# EAGLE schematic phoenixRev2 (EAGLE 8.5.2)

## Sheet 1 of 2
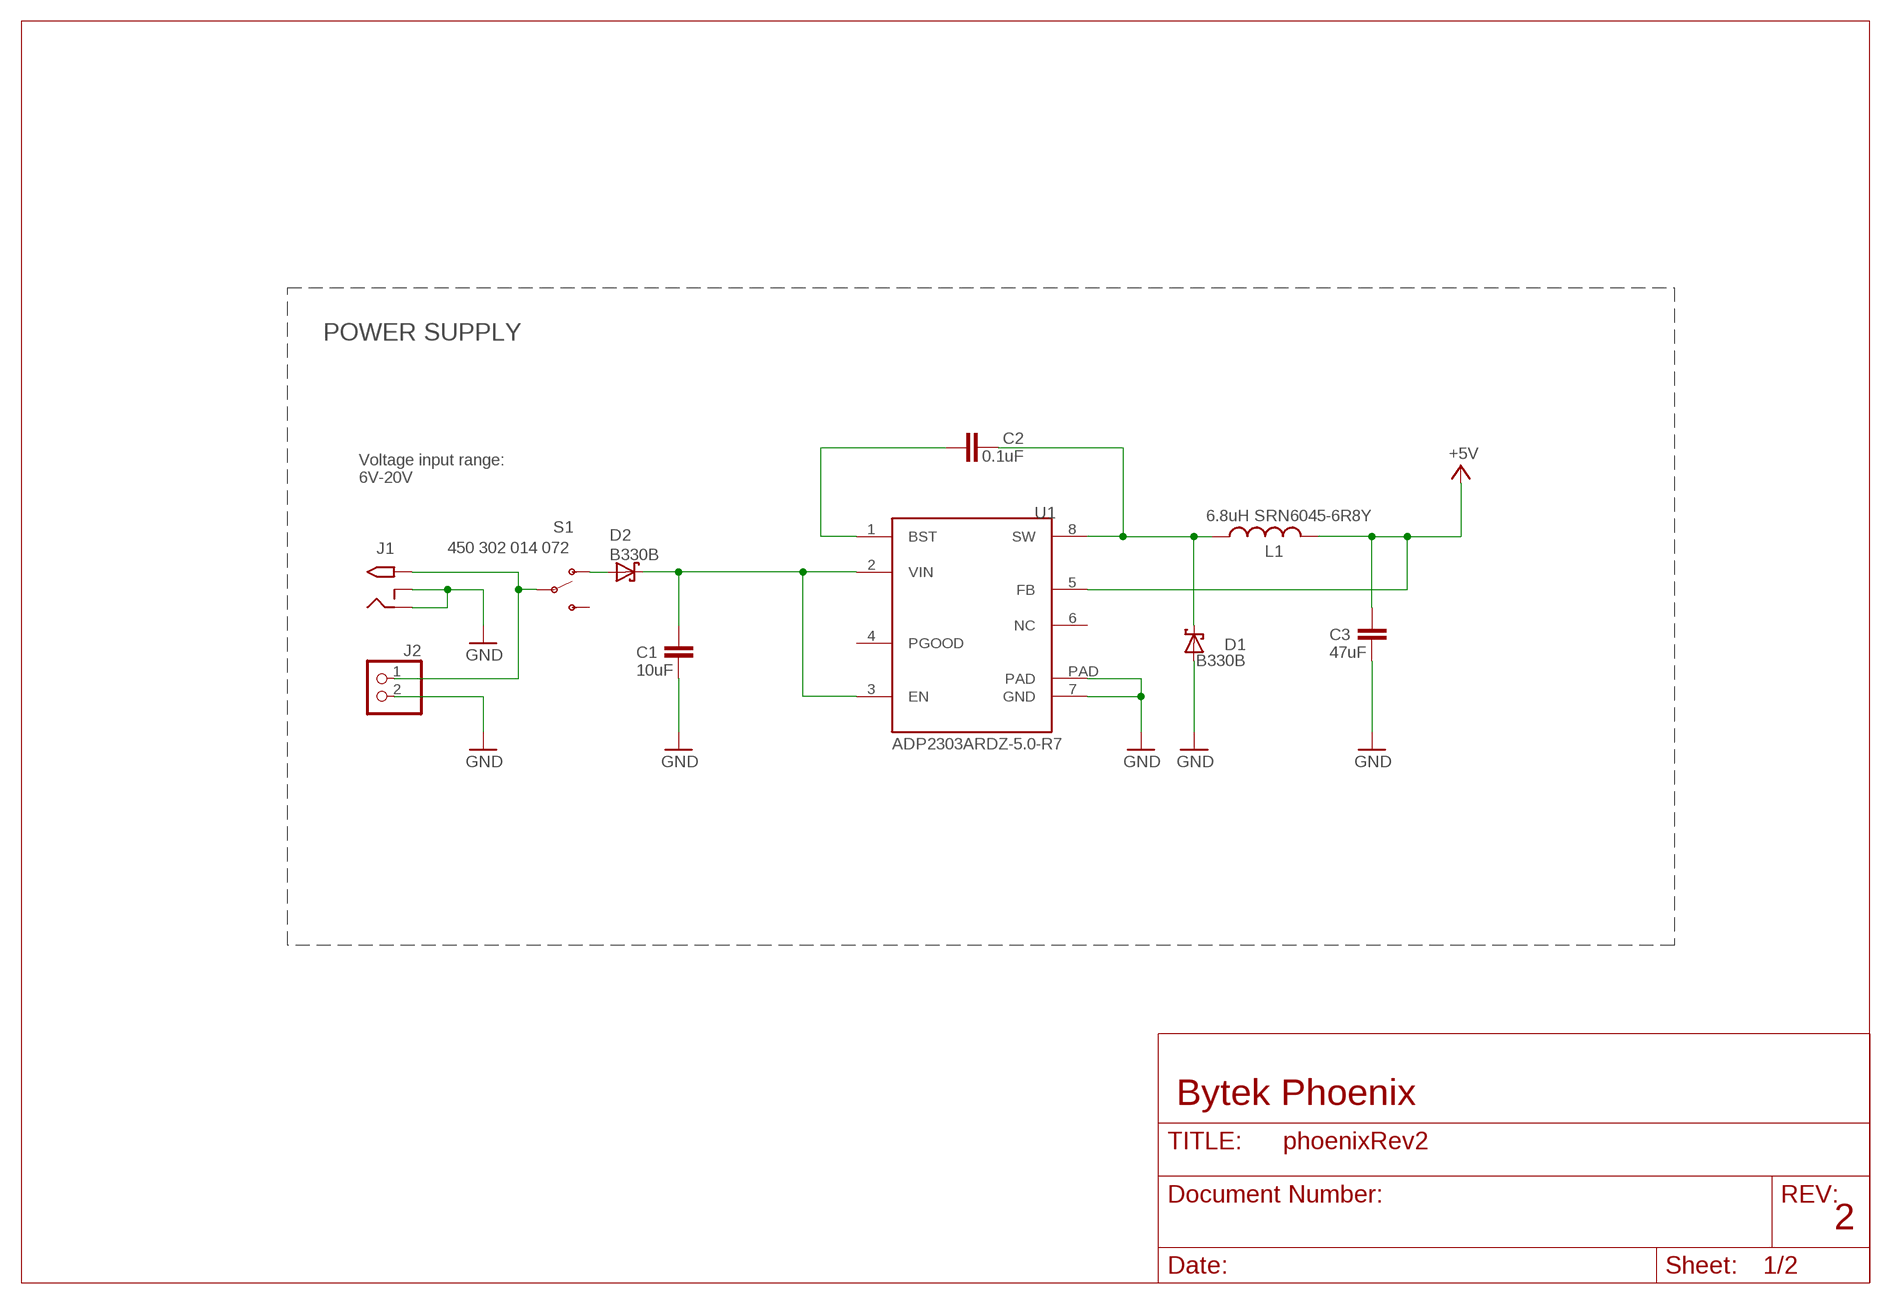
[diagram p0: schematic, sheet 1]

### Parts
C1  10uF  C-EUC0805  [C0805]
C2  0.1uF  C-EUC0805  [C0805]
C3  47uF  C-EUC1206  [C1206]
D1  B330B  SCHOTTKY-DIODESMD  [SMB]
D2  B330B  SCHOTTKY-DIODESMD  [SMB]
J1  2.1MMJACKTHM  [PJ-102A]
J2  PINHD-1X2  [1X02]
L1  6.8uH SRN6045-6R8Y  L-USWE-TPC  [POWER-CHOKE_WE-TPC]
S1  450 302 014 072  SWITCH-SPDT-PTH-11.6X4.0MM  [SWITCH_SPDT_PTH_11.6X4.0MM]
U1  ADP2303ARDZ-5.0-R7  ADP2303  [SO08_PAD]

### Nets
+5V: C3.1 L1.2 U1.5(FB) ; also sheet 2
GND: C1.2 C3.2 D1.A J1.RING J1.RING_SW J2.2 U1.7(GND) U1.PAD ; also sheet 2
N$1: D2.A S1.1(O)
N$24: C2.1 U1.1(BST)
N$32: C2.2 D1.C L1.1 U1.8(SW)
N$33: C1.1 D2.C U1.2(VIN) U1.3(EN)
N$36: J1.TIP J2.1 S1.2(P)
Unconnected: S1.3(S) U1.4(PGOOD) U1.6(NC)

### Notes on the sheet
- POWER SUPPLY
- Voltage input range:
  6V-20V
- Bytek Phoenix
- 2

## Sheet 2 of 2
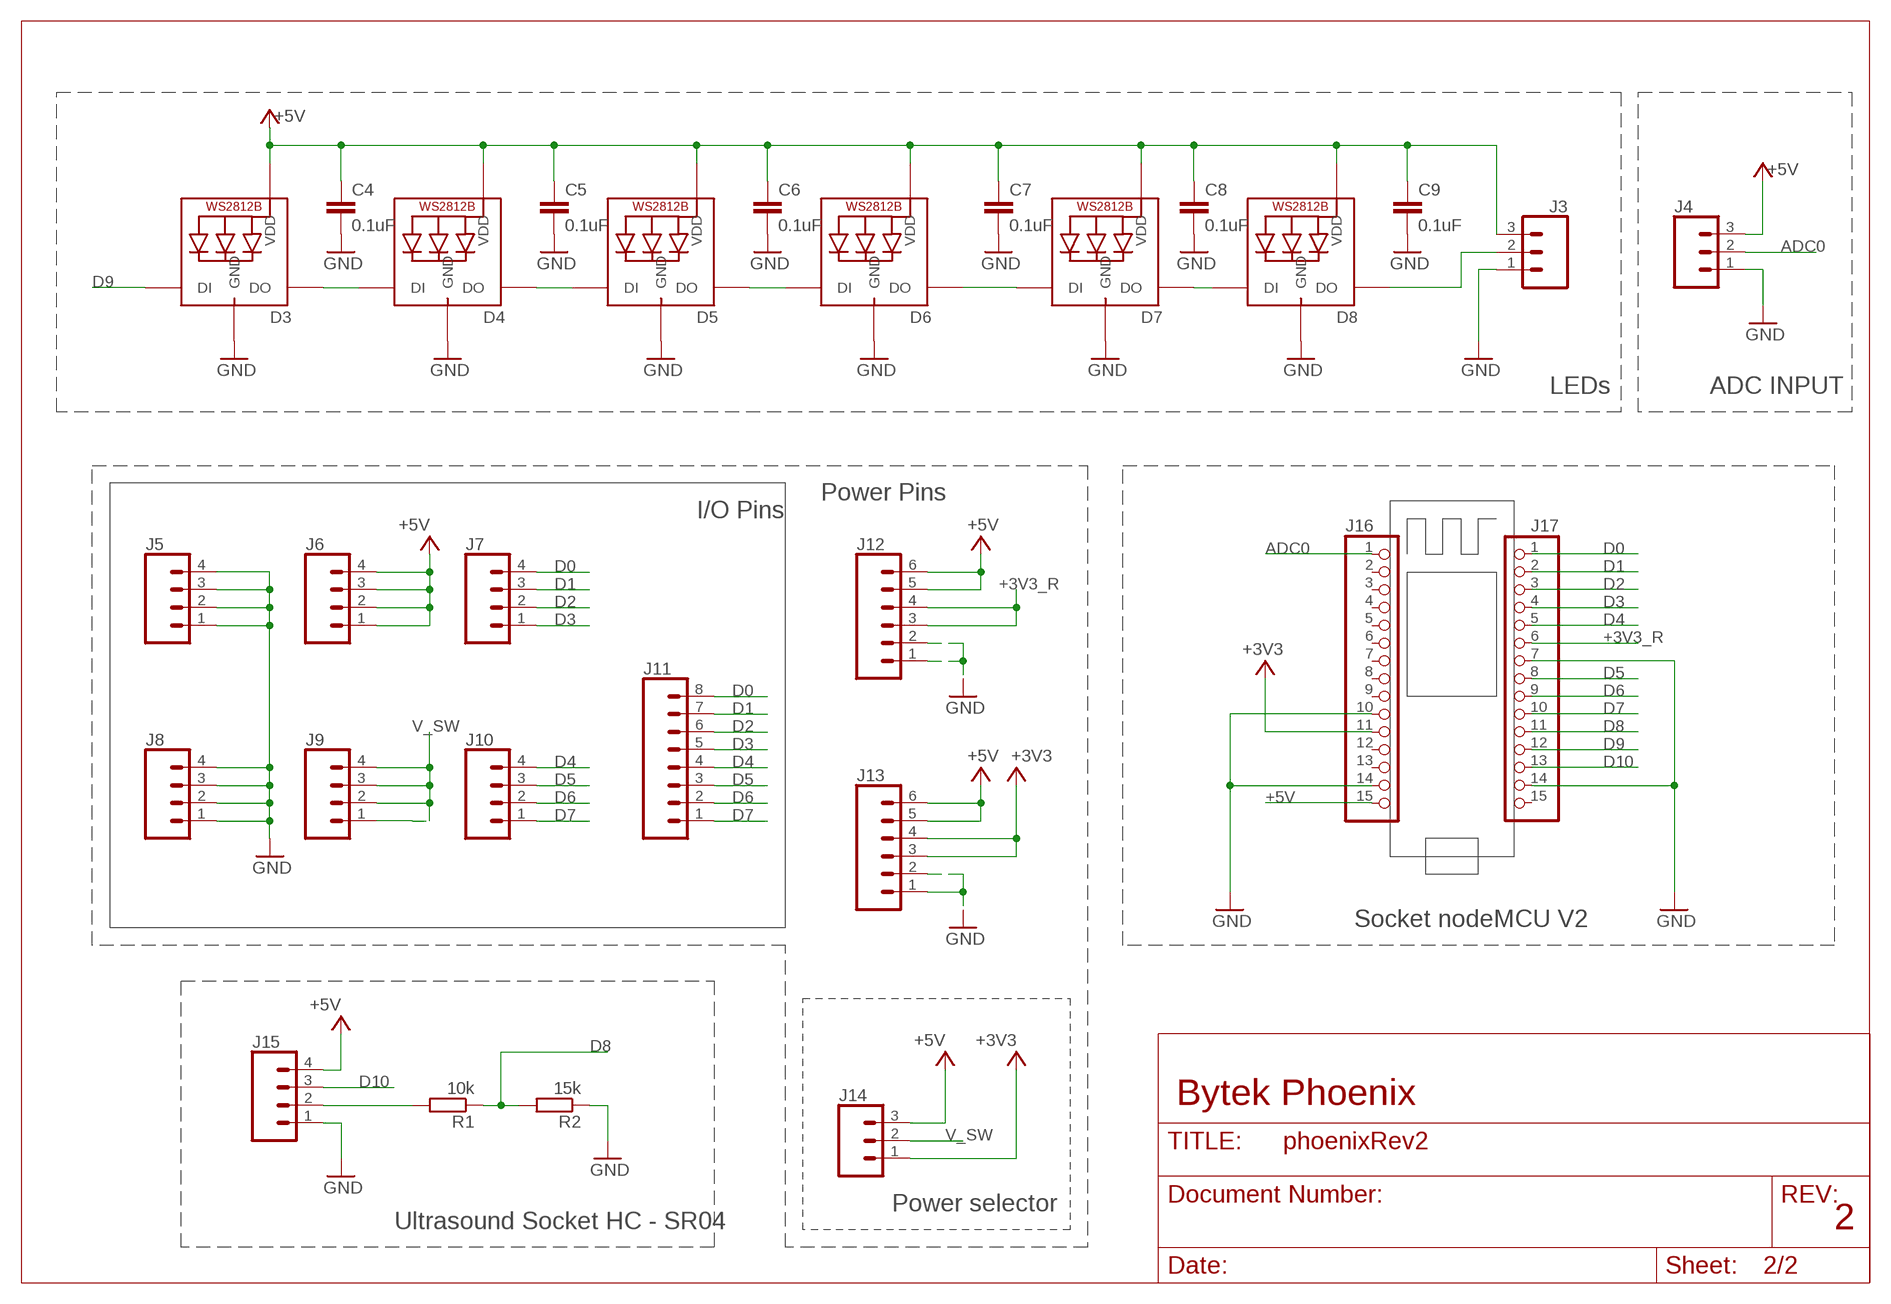
[diagram p1: schematic, sheet 2]

### Parts
C4  0.1uF  C-EUC0805  [C0805]
C5  0.1uF  C-EUC0805  [C0805]
C6  0.1uF  C-EUC0805  [C0805]
C7  0.1uF  C-EUC0805  [C0805]
C8  0.1uF  C-EUC0805  [C0805]
C9  0.1uF  C-EUC0805  [C0805]
D3  WS2812B5050  [WS2812B]
D4  WS2812B5050  [WS2812B]
D5  WS2812B5050  [WS2812B]
D6  WS2812B5050  [WS2812B]
D7  WS2812B5050  [WS2812B]
D8  WS2812B5050  [WS2812B]
J3  CONN_03  [1X03]
J4  CONN_03  [1X03]
J5  CONN_04  [1X04]
J6  CONN_04  [1X04]
J7  CONN_04  [1X04]
J8  CONN_04  [1X04]
J9  CONN_04  [1X04]
J10  CONN_04  [1X04]
J11  CONN_08"  [1X08]
J12  CONN_06SILK_FEMALE_PTH  [1X06]
J13  CONN_06SILK_FEMALE_PTH  [1X06]
J14  CONN_03  [1X03]
J15  CONN_04  [1X04]
J16  PINHD-1X15-CB  [1X15-CB]
J17  PINHD-1X15-CB  [1X15-CB]
R1  10k  R-EU_R0805  [R0805]
R2  15k  R-EU_R0805  [R0805]

### Nets
+3V3: J13.3 J13.4 J14.1 J16.11
+3V3_R: J12.3 J12.4 J17.6
+5V: C4.1 C5.1 C6.1 C7.1 C8.1 C9.1 D3.1-VDD(VDD) D4.1-VDD(VDD) D5.1-VDD(VDD) D6.1-VDD(VDD) D7.1-VDD(VDD) D8.1-VDD(VDD) J3.3 J4.3 J6.1 J6.2 J6.3 J6.4 J12.5 J12.6 J13.5 J13.6 J14.3 J15.4 J16.15 ; also sheet 1
ADC0: J4.2 J16.1
D0: J7.4 J11.8 J17.1
D1: J7.3 J11.7 J17.2
D2: J7.2 J11.6 J17.3
D3: J7.1 J11.5 J17.4
D4: J10.4 J11.4 J17.5
D5: J10.3 J11.3 J17.8
D6: J10.2 J11.2 J17.9
D7: J10.1 J11.1 J17.10
D8: J17.11 R1.1 R2.2
D9: D3.4-DIN(DI) J17.12
D10: J15.3 J17.13
GND: C4.2 C5.2 C6.2 C7.2 C8.2 C9.2 D3.3-GND(GND) D4.3-GND(GND) D5.3-GND(GND) D6.3-GND(GND) D7.3-GND(GND) D8.3-GND(GND) J3.1 J4.1 J5.1 J5.2 J5.3 J5.4 J8.1 J8.2 J8.3 J8.4 J12.1 J12.2 J13.1 J13.2 J15.1 J16.10 J16.14 J17.7 J17.14 R2.1 ; also sheet 1
N$2: D6.2-DOUT(DO) D7.4-DIN(DI)
N$3: D7.2-DOUT(DO) D8.4-DIN(DI)
N$4: D8.2-DOUT(DO) J3.2
N$34: D3.2-DOUT(DO) D4.4-DIN(DI)
N$35: D4.2-DOUT(DO) D5.4-DIN(DI)
N$38: J15.2 R1.2
N$40: D5.2-DOUT(DO) D6.4-DIN(DI)
V_SW: J9.1 J9.2 J9.3 J9.4 J14.2
Unconnected: J16.2 J16.3 J16.4 J16.5 J16.6 J16.7 J16.8 J16.9 J16.12 J16.13 J17.15

### Notes on the sheet
- D3 | D4 | D5 | D6 | D7 | D8
- LEDs | ADC INPUT
- Power Pins
- I/O Pins
- Socket nodeMCU V2
- Bytek Phoenix
- Power selector
- Ultrasound Socket HC - SR04 | 2

## Library data of the parts
C1-C3 C5-C9 = rcl:C-EU: CAPACITOR, European symbol
C4 = rcl:C-EU: CAPACITOR, European symbol; TYPE: Ceramic
D1 D2 = diode:SCHOTTKY-DIODE: Schottky Diode
D3-D8 = adafruit:WS2812B
J1 = adafruit:2.1MMJACK: 2.1mm x 5.5mm THM DC jack with internal switch. Digikey part #PJ-102A, 4UCON part #05537 2.1mm x 5.5mm SMT DC jack with internal switch. Digikey part #PJ-002A-SMT, 4UCON part #03267 By microbuilder.eu & adafruit.com
J2 = pinhead:PINHD-1X2: PIN HEADER
J3 J4 J14 = SparkFun-Connectors:CONN_03: Multi connection point. Often used as Generic Header-pin footprint for 0.1 inch spaced/style header connections On any of the 0.1 inch spaced packages, you can populate with these: Break Away Headers - Straight <https://www.sparkfun.com/products/116> (PRT-00116) Break Away Male Headers - Right Angle <https://www.sparkfun.com/products/553> (PRT-00553) Female Headers <https://www.sparkfun.com/products/115> (PRT-00115) Break Away Headers - Machine Pin <https://www.sparkfun.com/products/117> (PRT-00117) Break Away Female Headers - Swiss Machine Pin <https://www.sparkfun.com/products/743> (PRT-00743) Stackable Header - 3 Pin (Female, 0.1") <https://www.sparkfun.com/products/13875> (PRT-13875) For SCREWTERMINALS and SPRING TERMINALS visit here: Screw Terimnals on SparkFun.com <https://www.sparkfun.com/search/results?term=Screw+Terminals> (5mm/3.5mm/2.54mm spacing) This device is also useful as a general connection point to wire up your design to another part of your project. Our various solder wires solder well into these plated through hole pads. Hook-Up Wire - Assortment (Stranded, 22 AWG) <https://www.sparkfun.com/products/11375> (PRT-11375) Hook-Up Wire - Assortment (Solid Core, 22 AWG) <https://www.sparkfun.com/products/11367> (PRT-11367) View the entire wire category on our website here <https://www.sparkfun.com/categories/141> Special notes: Molex polarized connector foot print use with SKU : PRT-08232 with associated crimp pins and housings.
J5-J10 J15 = SparkFun-Connectors:CONN_04: Multi connection point. Often used as Generic Header-pin footprint for 0.1 inch spaced/style header connections On any of the 0.1 inch spaced packages, you can populate with these: Break Away Headers - Straight <https://www.sparkfun.com/products/116> (PRT-00116) Break Away Male Headers - Right Angle <https://www.sparkfun.com/products/553> (PRT-00553) Female Headers <https://www.sparkfun.com/products/115> (PRT-00115) Break Away Headers - Machine Pin <https://www.sparkfun.com/products/117> (PRT-00117) Break Away Female Headers - Swiss Machine Pin <https://www.sparkfun.com/products/743> (PRT-00743) For SCREWTERMINALS and SPRING TERMINALS visit here: Screw Terimnals on SparkFun.com <https://www.sparkfun.com/search/results?term=Screw+Terminals> (5mm/3.5mm/2.54mm spacing) This device is also useful as a general connection point to wire up your design to another part of your project. Our various solder wires solder well into these plated through hole pads. Hook-Up Wire - Assortment (Stranded, 22 AWG) <https://www.sparkfun.com/products/11375> (PRT-11375) Hook-Up Wire - Assortment (Solid Core, 22 AWG) <https://www.sparkfun.com/products/11367> (PRT-11367) View the entire wire category on our website here <https://www.sparkfun.com/categories/141> Special notes: Molex polarized connector foot print use with SKU : PRT-08231 with associated crimp pins and housings. 1MM SMD Version SKU: PRT-10208; PROD_ID: CONN-09696
J11 = SparkFun-Connectors:CONN_08: Multi connection point. Often used as Generic Header-pin footprint for 0.1 inch spaced/style header connections On any of the 0.1 inch spaced packages, you can populate with these: Break Away Headers - Straight <https://www.sparkfun.com/products/116> (PRT-00116) Break Away Male Headers - Right Angle <https://www.sparkfun.com/products/553> (PRT-00553) Female Headers <https://www.sparkfun.com/products/115> (PRT-00115) Break Away Headers - Machine Pin <https://www.sparkfun.com/products/117> (PRT-00117) Break Away Female Headers - Swiss Machine Pin <https://www.sparkfun.com/products/743> (PRT-00743) Arduino Stackable Header - 8 Pin <https://www.sparkfun.com/products/9279> (PRT-09279) For SCREWTERMINALS and SPRING TERMINALS visit here: Screw Terimnals on SparkFun.com <https://www.sparkfun.com/search/results?term=Screw+Terminals> (5mm/3.5mm/2.54mm spacing) This device is also useful as a general connection point to wire up your design to another part of your project. Our various solder wires solder well into these plated through hole pads. Hook-Up Wire - Assortment (Stranded, 22 AWG) <https://www.sparkfun.com/products/11375> (PRT-11375) Hook-Up Wire - Assortment (Solid Core, 22 AWG) <https://www.sparkfun.com/products/11367> (PRT-11367) View the entire wire category on our website here <https://www.sparkfun.com/categories/141> Special notes: Molex polarized connector foot print use with SKU : PRT-08231 with associated crimp pins and housings. 1MM SMD Version SKU: PRT-10208 NOTES ON THE VARIANTS LOCK and LOCK_LONGPADS... This footprint was designed to help hold the alignment of a through-hole component (i.e. 6-pin header) while soldering it into place. You may notice that each hole has been shifted either up or down by 0.005 of an inch from it's more standard position (which is a perfectly straight line). This slight alteration caused the pins (the squares in the middle) to touch the edges of the holes. Because they are alternating, it causes a "brace" to hold the component in place. 0.005 has proven to be the perfect amount of "off-center" position when using our standard breakaway headers. Although looks a little odd when you look at the bare footprint, once you have a header in there, the alteration is very hard to notice. Also,if you push a header all the way into place, it is covered up entirely on the bottom side.; PROD_ID: CONN-08438
J12 J13 = SparkFun-Connectors:CONN_06: Multi connection point. Often used as Generic Header-pin footprint for 0.1 inch spaced/style header connections On any of the 0.1 inch spaced packages, you can populate with these: Break Away Headers - Straight <https://www.sparkfun.com/products/116> (PRT-00116) Break Away Male Headers - Right Angle <https://www.sparkfun.com/products/553> (PRT-00553) Female Headers <https://www.sparkfun.com/products/115> (PRT-00115) Break Away Headers - Machine Pin <https://www.sparkfun.com/products/117> (PRT-00117) Break Away Female Headers - Swiss Machine Pin <https://www.sparkfun.com/products/743> (PRT-00743) Arduino Stackable Header - 6 Pin <https://www.sparkfun.com/products/9280> (PRT-09280) For SCREWTERMINALS and SPRING TERMINALS visit here: Screw Terimnals on SparkFun.com <https://www.sparkfun.com/search/results?term=Screw+Terminals> (5mm/3.5mm/2.54mm spacing) This device is also useful as a general connection point to wire up your design to another part of your project. Our various solder wires solder well into these plated through hole pads. Hook-Up Wire - Assortment (Stranded, 22 AWG) <https://www.sparkfun.com/products/11375> (PRT-11375) Hook-Up Wire - Assortment (Solid Core, 22 AWG) <https://www.sparkfun.com/products/11367> (PRT-11367) View the entire wire category on our website here <https://www.sparkfun.com/categories/141>; PROD_ID: CONN-08437
J16 J17 = adafruit:PINHD-1X15: PIN HEADER
L1 = servoController:L-US: INDUCTOR, American symbol
R1 R2 = rcl:R-EU_: RESISTOR, European symbol
S1 = SparkFun-Switches:SWITCH-SPDT: Single Pole, Double Throw (SPDT) Switch Single-pole, double-throw (SPDT) switch. Variant Overview SMD-AYZ0202 Surface Mount DPDT Switch <https://www.sparkfun.com/products/597> (COM-00597) Used on e.g. LilyPad Arduino USB - ATmega32U4 Board <https://www.sparkfun.com/products/12049> PTH-11.6X4.0MM SPDT Mini Power Switch <https://www.sparkfun.com/products/102> (COM-00102) Used on e.g. SparkFun Simon Says - Through-Hole Soldering Kit <https://www.sparkfun.com/products/10547> (KIT-10547) PTH-11.6X4.0MM-KIT KIT version of SPDT Mini Power Switch - Simplifies soldering by removing tStop of switch pins - only one side can be soldered. PTH-11.6X4.0MM-LOCK LOCK version of SPDT Mini Power Switch - Offset pins hold switch in place for easier soldering. SMD-RIGHT-ANGLE Surface Mount Right Angle Switch <https://www.sparkfun.com/products/10860> (COM-10860) Used on e.g. SparkFun ESP8266 Thing <https://www.sparkfun.com/products/13231>; PROD_ID: SWCH-08261; SF_SKU: COM-00102
U1 = servoController:ADP2303